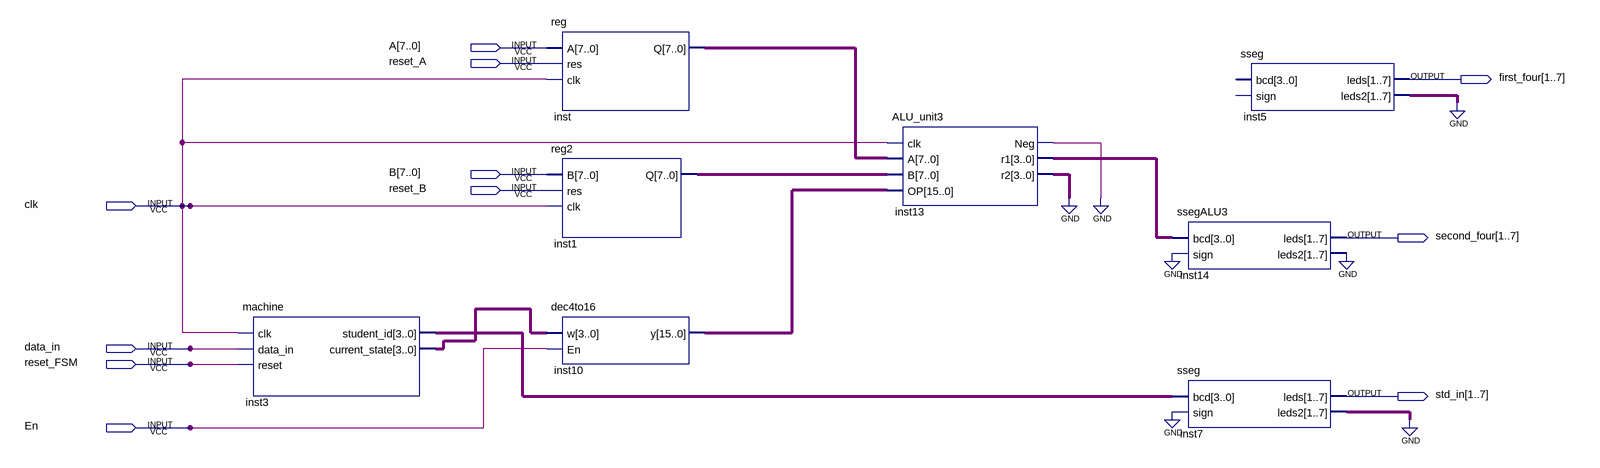
[diagram p0: schematic sheet]
// Quartus schematic Problem3BDF.bdf as structural Verilog: 8 symbols, 11 pins
module Problem3BDF (
  input  [7:0] A,
  input  reset_A,
  input  [7:0] B,
  input  reset_B,
  input  clk,
  input  data_in,
  input  reset_FSM,
  input  En,
  output [1:7] first_four,
  output [1:7] second_four,
  output [1:7] std_in
);

  wire inst13_neg;
  wire [3:0] inst3_current_state, inst3_student_id, inst13_r1, inst13_r2;
  wire [6:0] inst5_leds2, inst7_leds2, inst14_leds2;
  wire [7:0] inst1_q, inst_q;
  wire [15:0] inst10_y;

  machine inst3 (
    .clk(clk), .data_in(data_in), .reset(reset_FSM), .student_id(inst3_student_id),
    .current_state(inst3_current_state));
  \reg  inst (.clk(clk), .Q(inst_q));  // open: A, res
  reg2 inst1 (.clk(clk), .Q(inst1_q));  // open: B, res
  dec4to16 inst10 (.w(inst3_current_state), .En(En), .y(inst10_y));
  ALU_unit3 inst13 (
    .clk(clk), .A(inst_q), .B(inst1_q), .OP(inst10_y), .Neg(inst13_neg), .r1(inst13_r1), .r2(inst13_r2));
  ssegALU3 inst14 (.bcd(inst13_r1), .sign(1'b0), .leds(second_four), .leds2(inst14_leds2));
  sseg inst7 (.bcd(inst3_student_id), .sign(1'b0), .leds(std_in), .leds2(inst7_leds2));
  sseg inst5 (.leds(first_four), .leds2(inst5_leds2));  // open: bcd, sign
  // also tied to GND on the sheet: {inst7_leds2[0], inst7_leds2[1], inst7_leds2[2], inst7_leds2[3], inst7_leds2[4], inst7_leds2[5], inst7_leds2[6], inst5_leds2[0], inst5_leds2[1], inst5_leds2[2], inst5_leds2[3], inst5_leds2[4], inst5_leds2[5], inst5_leds2[6], inst13_r2[0], inst13_r2[1], inst13_r2[2], inst13_r2[3], inst13_neg, inst14_leds2[0], inst14_leds2[1], inst14_leds2[2], inst14_leds2[3], inst14_leds2[4], inst14_leds2[5], inst14_leds2[6]}
endmodule
